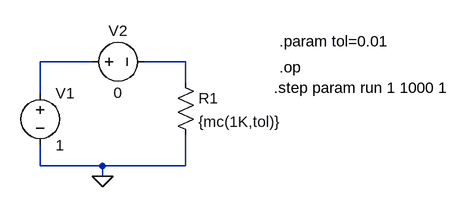
[diagram p0: schematic montecarlo.asc]
montecarlo.asc, the LTspice schematic file:
Version 4
SHEET 1 880 680
WIRE 128 96 48 96
WIRE 272 96 208 96
WIRE 272 128 272 96
WIRE 48 144 48 96
WIRE 48 256 48 224
WIRE 144 256 48 256
WIRE 272 256 272 208
WIRE 272 256 144 256
WIRE 144 272 144 256
FLAG 144 272 0
SYMBOL res 256 112 R0
SYMATTR InstName R1
SYMATTR Value {mc(1K,tol)}
SYMBOL voltage 48 128 R0
WINDOW 123 0 0 Left 0
WINDOW 39 0 0 Left 0
SYMATTR InstName V1
SYMATTR Value 1
SYMBOL voltage 112 96 R270
WINDOW 0 32 56 VTop 2
WINDOW 3 -32 56 VBottom 2
WINDOW 123 0 0 Left 0
WINDOW 39 0 0 Left 0
SYMATTR InstName V2
SYMATTR Value 0
TEXT 416 64 Left 2 !.param tol=0.01
TEXT 416 104 Left 2 !.op
TEXT 408 136 Left 2 !.step param run 1 1000 1

The netlist it stands for:
* montecarlo.asc
R1 N002 0 {mc(1K,tol)}
V1 N001 0 1
V2 N001 N002 0
.param tol=0.01
.op
.step param run 1 1000 1
.backanno
.end